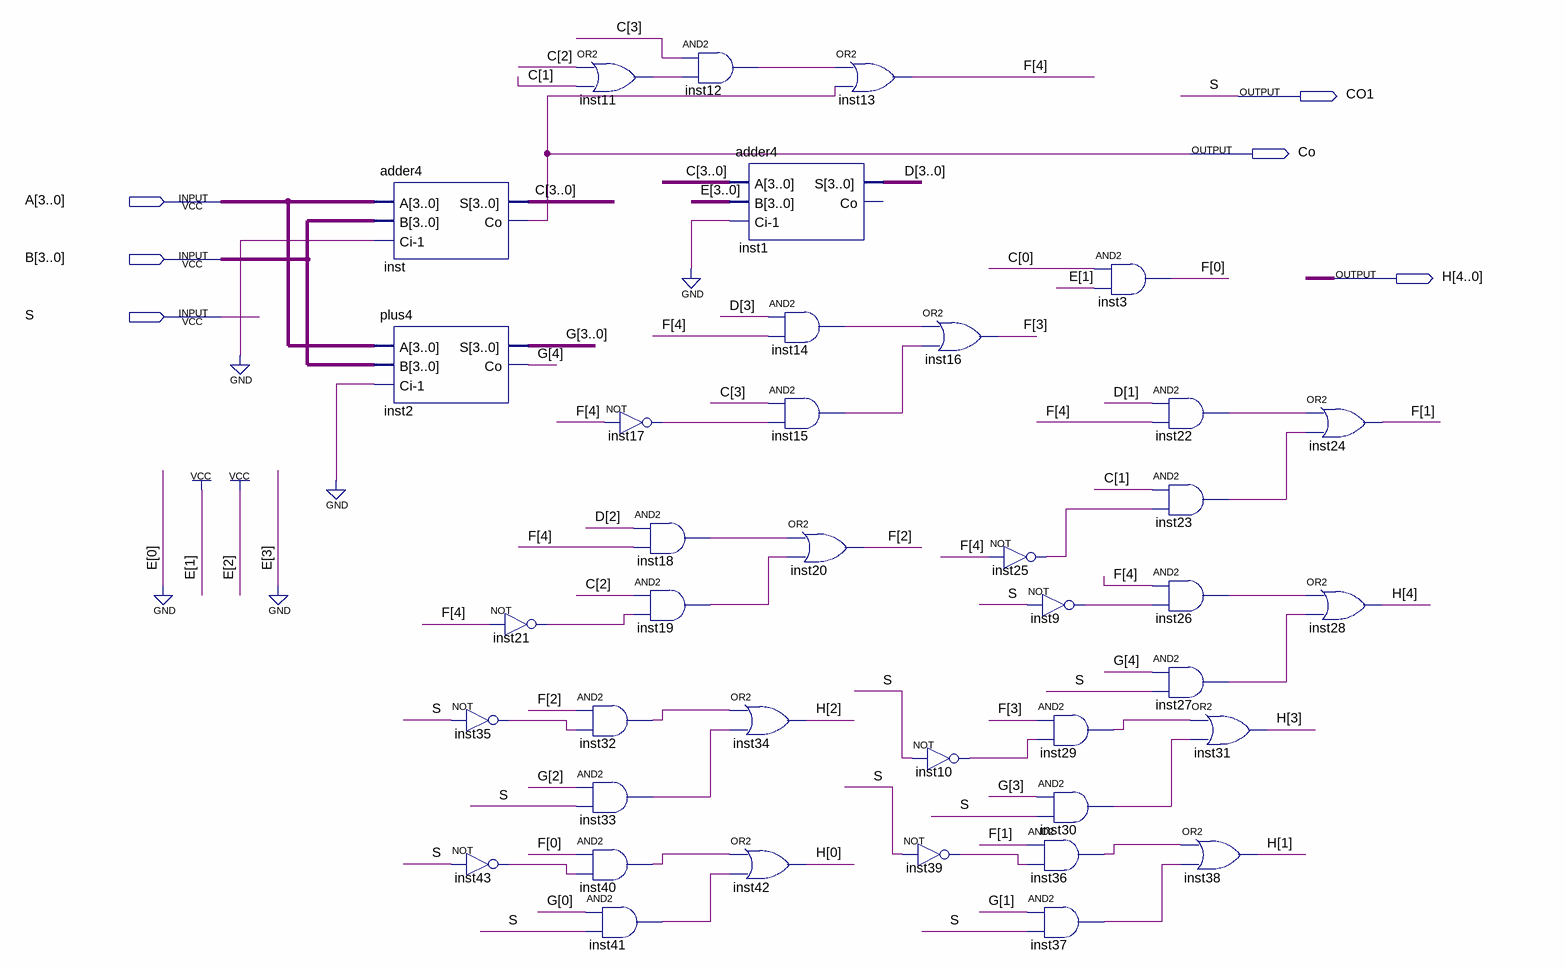
[diagram p0: schematic sheet]
// Quartus schematic adder4NB.bdf as structural Verilog: 39 symbols, 6 pins
module adder4NB (
  input  [3:0] A,
  input  [3:0] B,
  input  S,
  output CO1,
  output Co,
  output [4:0] H
);

  wire inst9_out, inst10_out, inst11_out, inst12_out, inst14_out, inst15_out, inst17_out, inst18_out,
       inst19_out, inst21_out, inst22_out, inst23_out, inst25_out, inst26_out, inst27_out, inst29_out,
       inst30_out, inst32_out, inst33_out, inst35_out, inst36_out, inst37_out, inst39_out, inst40_out,
       inst41_out, inst43_out;
  wire [3:0] C, D;
  wire [4:0] F, G;

  adder4 inst (.A(A), .B(B), .\Ci-1 (1'b0), .S(C), .Co(Co));
  plus4 inst2 (.A(A), .B(B), .\Ci-1 (1'b0), .S(G[3:0]), .Co(G[4]));
  not inst21 (inst21_out, F[4]);
  not inst35 (inst35_out, S);
  not inst43 (inst43_out, S);
  or inst11 (inst11_out, C[2], C[1]);
  and inst32 (inst32_out, F[2], inst35_out);
  and inst33 (inst33_out, G[2], S);
  and inst40 (inst40_out, F[0], inst43_out);
  and inst41 (inst41_out, G[0], S);
  not inst17 (inst17_out, F[4]);
  and inst18 (inst18_out, D[2], F[4]);
  and inst19 (inst19_out, C[2], inst21_out);
  and inst12 (inst12_out, C[3], inst11_out);
  adder4 inst1 (.A(C), .B(4'b0110), .\Ci-1 (1'b0), .S(D));  // open: Co
  or inst34 (H[2], inst32_out, inst33_out);
  or inst42 (H[0], inst40_out, inst41_out);
  and inst14 (inst14_out, D[3], F[4]);
  and inst15 (inst15_out, C[3], inst17_out);
  or inst20 (F[2], inst18_out, inst19_out);
  or inst13 (F[4], inst12_out, Co);
  not inst39 (inst39_out, S);
  or inst16 (F[3], inst14_out, inst15_out);
  not inst10 (inst10_out, S);
  not inst25 (inst25_out, F[4]);
  not inst9 (inst9_out, S);
  and inst29 (inst29_out, F[3], inst10_out);
  and inst30 (inst30_out, G[3], S);
  and inst36 (inst36_out, F[1], inst39_out);
  and inst37 (inst37_out, G[1], S);
  and inst3 (F[0], C[0], 1'b1);
  and inst22 (inst22_out, D[1], F[4]);
  and inst23 (inst23_out, C[1], inst25_out);
  and inst26 (inst26_out, F[4], inst9_out);
  and inst27 (inst27_out, G[4], S);
  or inst31 (H[3], inst29_out, inst30_out);
  or inst38 (H[1], inst36_out, inst37_out);
  or inst24 (F[1], inst22_out, inst23_out);
  or inst28 (H[4], inst26_out, inst27_out);

  assign CO1 = S;
endmodule
